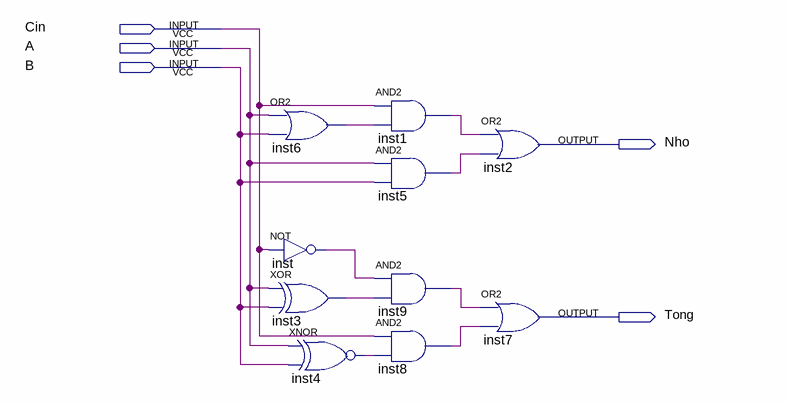
[diagram p0: schematic sheet]
// Quartus schematic Full_Adder.bdf as structural Verilog: 10 symbols, 5 pins
module Full_Adder (
  input  Cin,
  input  A,
  input  B,
  output Nho,
  output Tong
);

  wire inst1_out, inst3_out, inst4_out, inst5_out, inst6_out, inst8_out, inst9_out, inst_out;

  or inst6 (inst6_out, A, B);
  not inst (inst_out, Cin);
  xor inst3 (inst3_out, A, B);
  xnor inst4 (inst4_out, A, B);
  and inst1 (inst1_out, Cin, inst6_out);
  and inst5 (inst5_out, A, B);
  and inst9 (inst9_out, inst_out, inst3_out);
  and inst8 (inst8_out, Cin, inst4_out);
  or inst2 (Nho, inst1_out, inst5_out);
  or inst7 (Tong, inst9_out, inst8_out);
endmodule
